# Altium schematic sheet DSO_Power.SchDoc: Schematic_Name
size A4; CompanyName: University of Melbourne; Engineer: Your Name Here; DocumentNumber: 1; Revision: 0.1; SheetNumber: 1; SheetTotal: 1; Title_Project: Project_Title; StudentNo: Student No.
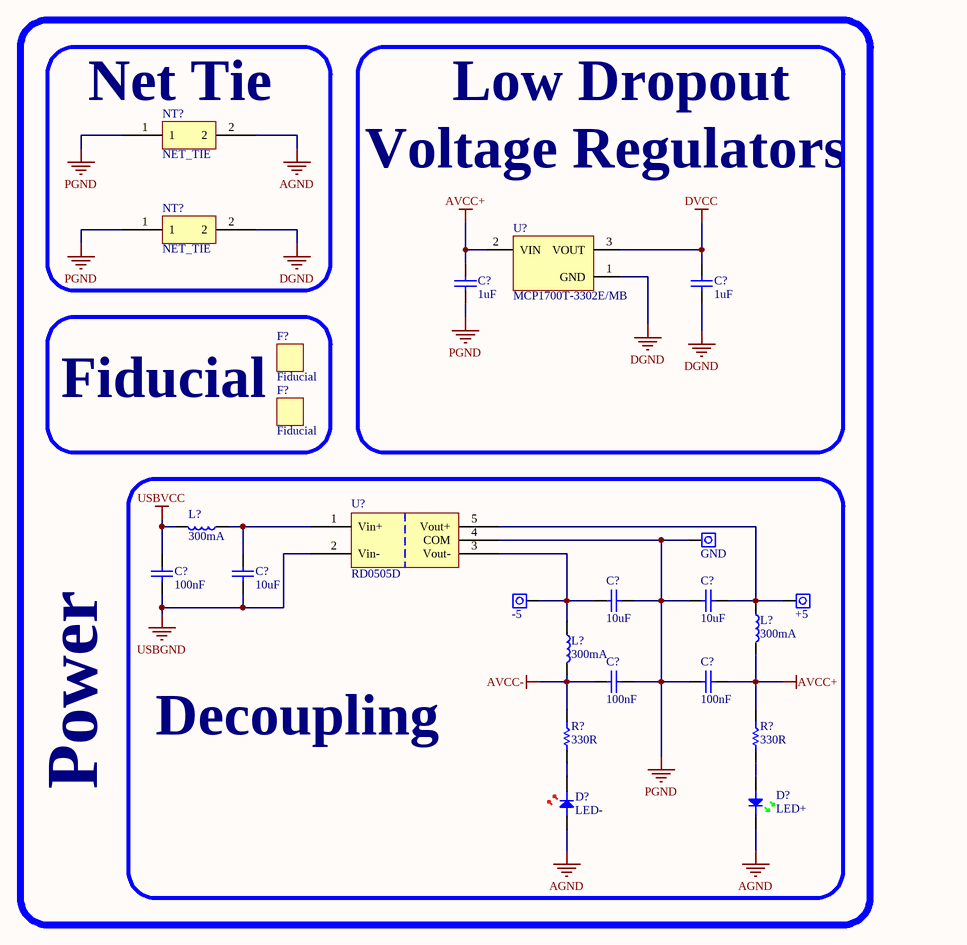
[diagram p0: DSO_Power.SchDoc]

## Parts
(Parts that share a designator on the sheet are numbered #1, #2 ... from top to bottom, then left to right.)
C?#1  1uF  [0805C]
C?#2  1uF  [0805C]
C?#3  100nF  [0805C]
C?#4  10uF  [0805C]
C?#5  10uF  [0805C]
C?#6  10uF  [0805C]
C?#7  100nF  [0805C]
C?#8  100nF  [0805C]
D?#1  LED+  [0805D-GREEN]
D?#2  LED-  [0805D-RED]
F?#1  Fiducial  [Fiducial]  (no BOM)
F?#2  Fiducial  [Fiducial]  (no BOM)
L?#1  300mA  [0805]
L?#2  300mA  [0805]
L?#3  300mA  [0805]
NT?#1  NET_TIE  [NET_TIE]  (net tie, no BOM)
NT?#2  NET_TIE  [NET_TIE]  (net tie, no BOM)
R?#1  330R  [0805]
R?#2  330R  [0805]
TP?#1  GND  [PIN 1.8mm]
TP?#2  -5  [PIN 1.8mm]
TP?#3  +5  [PIN 1.8mm]
U?#1  MCP1700T-3302E/MB  [SOT89]
U?#2  RD0505D  [SIP_NMG]

## Blocks framed on the sheet
Power: C?#1 C?#2 U?#1
Net Tie: NT?#1 NT?#2
Fiducial: F?#1 F?#2
Decoupling: C?#3-C?#8 D?#1 D?#2 L?#1-L?#3 R?#1 R?#2 TP?#1-TP?#3 U?#2

## Nets
AGND: D?#1.K D?#2.A NT?#1.2
AVCC+: C?#1.2 C?#8.1 L?#2.2 R?#2.1 U?#1.2(VIN)
AVCC-: C?#7.2 L?#3.2 R?#1.1
DGND: C?#2.1 NT?#2.2 U?#1.1(GND)
DVCC: C?#2.2 U?#1.3(VOUT)
PGND: C?#1.1 C?#5.1 C?#6.2 C?#7.1 C?#8.2 NT?#1.1 NT?#2.1 TP?#1.1 U?#2.4(COM)
USBGND: C?#3.1 C?#4.1 U?#2.2(Vin-)
USBVCC: C?#3.2 L?#1.2
NetC?#4_2: C?#4.2 L?#1.1 U?#2.1(Vin+)
NetC?#5_2: C?#5.2 L?#3.1 TP?#2.1 U?#2.3(Vout-)
NetC?#6_1: C?#6.1 L?#2.1 TP?#3.1 U?#2.5(Vout+)
NetD?#1_A: D?#1.A R?#2.2
NetD?#2_K: D?#2.K R?#1.2

## Notes on the sheet
- Low Dropout
- Voltage Regulators

## Library data of the parts
C?#1-C?#8 = C: Capacitor; Reviewed by: RM - 2018/08/05; Revision: July-2002: Re-released for DXP Platform.; Supplier 1: *; Supplier Part Number 1: *
  C?#1 C?#2: Value: 1uF
  C?#3 C?#7 C?#8: Value: 100nF
  C?#4-C?#6: Value: 10uF
D?#1 = LED GREEN: Light Emitting Diode; Reviewed by: RM - 2018/08/05; Revision: July-2002: Re-released for DXP Platform.; Supplier 1: Digi-Key; Supplier Part Number 1: 160-1423-1-ND
D?#2 = LED RED: Light Emitting Diode; Reviewed by: RM - 2018/08/05; Revision: July-2002: Re-released for DXP Platform.; Supplier 1: Digi-Key; Supplier Part Number 1: 475-1415-1-ND
L?#1-L?#3 = I: Inductor; Reviewed by: RM - 2018/08/05; Supplier 1: *; Supplier Part Number 1: *; Value: 300mA
NT?#1 NT?#2 = NET_TIE: Net Tie
R?#1 R?#2 = R: Resistor; Reviewed by: RM - 2018/08/05; Value: 330R; Supplier 1: *; Suppler Part Number 1: *
TP?#1-TP?#3 = WIRE: Pad
U?#1 = MCP1700T: Low Quiescent Current LDO, 3-Pin SOT-89, Extended Temperature, Tape and Reel; Reviewed by: RM - 2018/08/05; Supplier 1: Digi-Key; Supplier Part Number 1: MCP1700T3302EMBCT-ND
U?#2 = RD0505D: (ADV) DC to DC converter 5V in +-5V out; Reviewed by: RM - 2018/08/05; Supplier Part Number 1: 945-1136-ND; Supplier 1: Digi-Key